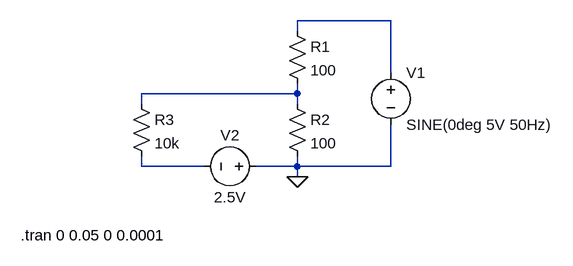
[diagram p0: schematic symulacja_uklad_w_LTspice-IV.asc]
symulacja_uklad_w_LTspice-IV.asc, the LTspice schematic file:
Version 4
SHEET 1 880 680
WIRE 368 32 224 32
WIRE 224 48 224 32
WIRE 368 112 368 32
WIRE 224 144 224 128
WIRE 224 144 -16 144
WIRE -16 160 -16 144
WIRE 224 160 224 144
WIRE -16 256 -16 240
WIRE 80 256 -16 256
WIRE 224 256 224 240
WIRE 224 256 160 256
WIRE 368 256 368 192
WIRE 368 256 224 256
WIRE 224 272 224 256
FLAG 224 272 0
SYMBOL res 208 32 R0
SYMATTR InstName R1
SYMATTR Value 100
SYMBOL res 208 144 R0
SYMATTR InstName R2
SYMATTR Value 100
SYMBOL voltage 368 96 R0
WINDOW 123 0 0 Left 2
WINDOW 39 0 0 Left 2
SYMATTR InstName V1
SYMATTR Value SINE(0deg 5V 50Hz)
SYMBOL voltage 176 256 R90
WINDOW 0 -32 56 VBottom 2
WINDOW 3 32 56 VTop 2
WINDOW 123 0 0 Left 2
WINDOW 39 0 0 Left 2
SYMATTR InstName V2
SYMATTR Value 2.5V
SYMBOL res -32 144 R0
SYMATTR InstName R3
SYMATTR Value 10k
TEXT -202 362 Left 2 !.tran 0 0.05 0 0.0001

The netlist it stands for:
* symulacja_uklad_w_LTspice-IV.asc
R1 N001 N002 100
R2 N002 0 100
V1 N001 0 SINE(0deg 5V 50Hz)
V2 0 N003 2.5V
R3 N002 N003 10k
.tran 0 0.05 0 0.0001
.backanno
.end